# Altium schematic sheet DAC5672.SchDoc
size A4
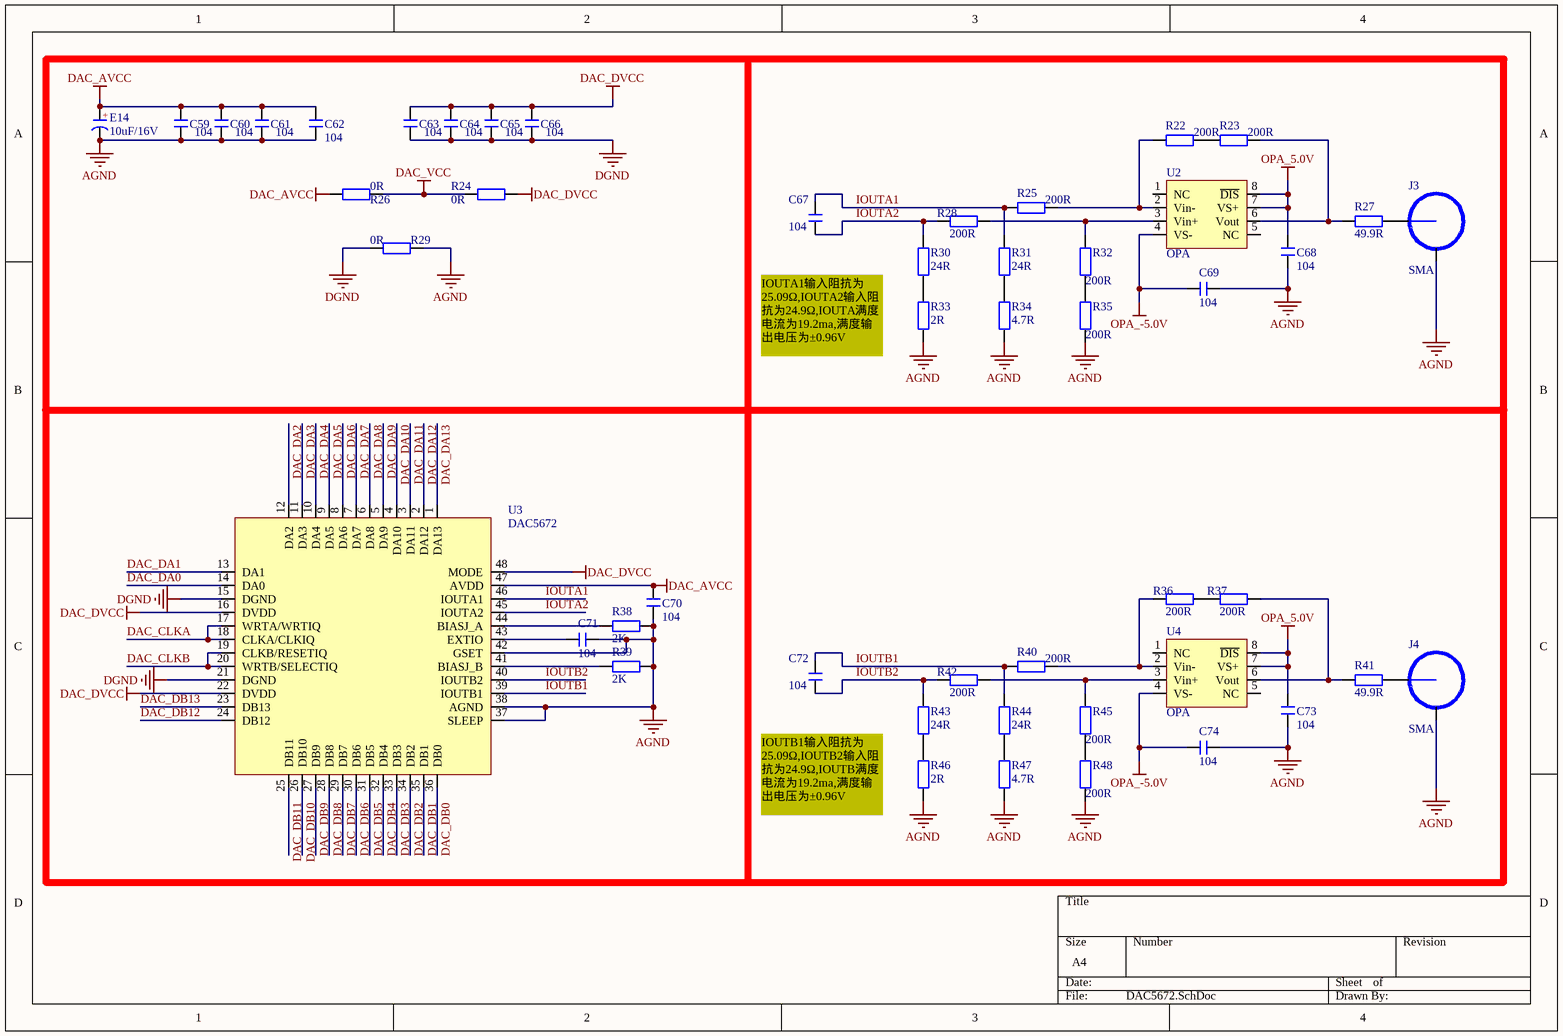
[diagram p0: DAC5672.SchDoc]

## Parts
C59  104  [C 0805_M]
C60  104  [C 0805_M]
C61  104  [C 0805_M]
C62  104  [C 0805_M]
C63  104  [C 0805_M]
C64  104  [C 0805_M]
C65  104  [C 0805_M]
C66  104  [C 0805_M]
C67  104  [C 0805_M]
C68  104  [C 0805_M]
C69  104  [C 0805_M]
C70  104  [C 0805_M]
C71  104  [C 0805_M]
C72  104  [C 0805_M]
C73  104  [C 0805_M]
C74  104  [C 0805_M]
E14  10uF/16V  [C 1210_M]
J3  SMA  [SMA_FR]
J4  SMA  [SMA_FR]
R22  200R  [R 0805_M]
R23  200R  [R 0805_M]
R24  0R  [R 0805_M]
R25  200R  [R 0805_M]
R26  0R  [R 0805_M]
R27  49.9R  [R 0805_M]
R28  200R  [R 0805_M]
R29  0R  [R 1206_M]
R30  24R  [R 0805_M]
R31  24R  [R 0805_M]
R32  200R  [R 0805_M]
R33  2R  [R 0805_M]
R34  4.7R  [R 0805_M]
R35  200R  [R 0805_M]
R36  200R  [R 0805_M]
R37  200R  [R 0805_M]
R38  2K  [R 0805_M]
R39  2K  [R 0805_M]
R40  200R  [R 0805_M]
R41  49.9R  [R 0805_M]
R42  200R  [R 0805_M]
R43  24R  [R 0805_M]
R44  24R  [R 0805_M]
R45  200R  [R 0805_M]
R46  2R  [R 0805_M]
R47  4.7R  [R 0805_M]
R48  200R  [R 0805_M]
U2  OPA  [SOP8_M]
U3  DAC5672  [TQFP48 7x7_M]
U4  OPA  [SOP8_M]

## Nets
AGND: C59.1 C60.1 C61.1 C62.1 C68.1 C69.1 C70.1 C71.2 C73.1 C74.1 E14.2(K) J3.2 J4.2 R29.2 R33.1 R34.2 R35.2 R38.2 R39.2 R46.1 R47.2 R48.2 U3.37(SLEEP) U3.38(AGND) U3.42(GSET)
DAC_AVCC: C59.2 C60.2 C61.2 C62.2 C70.2 E14.1(A) R26.1 U3.47(AVDD)
DAC_DVCC: C63.2 C64.2 C65.2 C66.2 R24.2 U3.16(DVDD) U3.22(DVDD) U3.48(MODE)
DAC_VCC: R24.1 R26.2
DGND: C63.1 C64.1 C65.1 C66.1 R29.1 U3.15(DGND) U3.21(DGND)
OPA_5.0V: C68.2 C73.2 U2.7(VS+) U2.8(~{DIS}) U4.7(VS+) U4.8(~{DIS})
OPA_-5.0V: C69.2 C74.2 U2.4(VS-) U4.4(VS-)
DAC_CLKA: U3.17(WRTA/WRTIQ) U3.18(CLKA/CLKIQ)
DAC_CLKB: U3.19(CLKB/RESETIQ) U3.20(WRTB/SELECTIQ)
DAC_DA0: U3.14(DA0)
DAC_DA1: U3.13(DA1)
DAC_DA2: U3.12(DA2)
DAC_DA3: U3.11(DA3)
DAC_DA4: U3.10(DA4)
DAC_DA5: U3.9(DA5)
DAC_DA6: U3.8(DA6)
DAC_DA7: U3.7(DA7)
DAC_DA8: U3.6(DA8)
DAC_DA9: U3.5(DA9)
DAC_DA10: U3.4(DA10)
DAC_DA11: U3.3(DA11)
DAC_DA12: U3.2(DA12)
DAC_DA13: U3.1(DA13)
DAC_DB0: U3.36(DB0)
DAC_DB1: U3.35(DB1)
DAC_DB2: U3.34(DB2)
DAC_DB3: U3.33(DB3)
DAC_DB4: U3.32(DB4)
DAC_DB5: U3.31(DB5)
DAC_DB6: U3.30(DB6)
DAC_DB7: U3.29(DB7)
DAC_DB8: U3.28(DB8)
DAC_DB9: U3.27(DB9)
DAC_DB10: U3.26(DB10)
DAC_DB11: U3.25(DB11)
DAC_DB12: U3.24(DB12)
DAC_DB13: U3.23(DB13)
IOUTA1: C67.1 R25.2 R31.1 U3.46(IOUTA1)
IOUTA2: C67.2 R28.2 R30.2 U3.45(IOUTA2)
IOUTB1: C72.1 R40.2 R44.1 U3.39(IOUTB1)
IOUTB2: C72.2 R42.2 R43.2 U3.40(IOUTB2)
NetC71_1: C71.1 U3.43(EXTIO)
NetJ3_1: J3.1 R27.2
NetJ4_1: J4.1 R41.2
NetR22_1: R22.1 R23.2
NetR22_2: R22.2 R25.1 U2.2(Vin-)
NetR23_1: R23.1 R27.1 U2.6(Vout)
NetR28_1: R28.1 R32.1 U2.3(Vin+)
NetR30_1: R30.1 R33.2
NetR31_2: R31.2 R34.1
NetR32_2: R32.2 R35.1
NetR36_1: R36.1 R37.2
NetR36_2: R36.2 R40.1 U4.2(Vin-)
NetR37_1: R37.1 R41.1 U4.6(Vout)
NetR38_1: R38.1 U3.44(BIASJ_A)
NetR39_1: R39.1 U3.41(BIASJ_B)
NetR42_1: R42.1 R45.2 U4.3(Vin+)
NetR43_1: R43.1 R46.2
NetR44_2: R44.2 R47.1
NetR45_1: R45.1 R48.1

Not connected (* = marked no-connect by the designer): U2 1(NC) 5(NC); U4 1(NC) 5(NC)

## Notes on the sheet
- IOUTA1输入阻抗为25.09Ω,IOUTA2输入阻抗为24.9Ω,IOUTA满度电流为19.2ma,满度输出电压为±0.96V
- IOUTB1输入阻抗为25.09Ω,IOUTB2输入阻抗为24.9Ω,IOUTB满度电流为19.2ma,满度输出电压为±0.96V
- (in symbol C-CAP) +

## Library data of the parts
C59-C74 = C: 无极性贴片电容; 版权归属: 源创客; BOM名称: 无极性贴片电容; 学习资源: www.ooocke.com
E14 = C-CAP: 直插电解电容; 版权归属: 源创客; BOM名称: 直插电解电容; 学习资源: www.ooocke.com
R22-R48 = R: 贴片电阻; 版权归属: 源创客; BOM名称: 贴片电阻; 学习资源: www.ooocke.com
U2 U4 = 单运放